# EAGLE design FunctionGeneratorGateDriver (EAGLE 9.3.2)
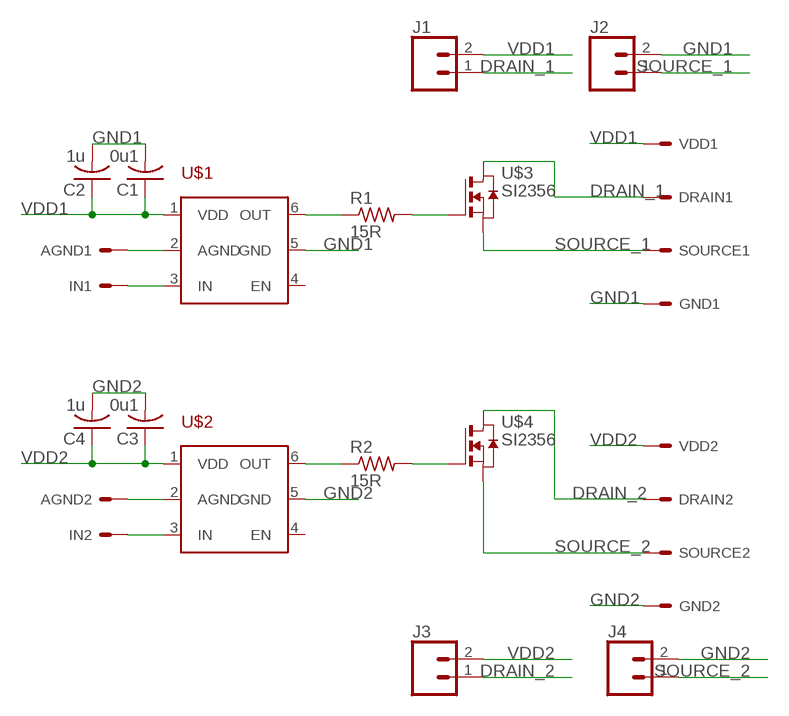
[diagram p0: schematic, sheet 1]

## Parts
AGND1  P1X1  [1X01]
AGND2  P1X1  [1X01]
C1  0u1  C-USC1206  [C1206]
C2  1u  C-USC1206  [C1206]
C3  0u1  C-USC1206  [C1206]
C4  1u  C-USC1206  [C1206]
DRAIN1  P1X1  [1X01]
DRAIN2  P1X1  [1X01]
GND1  P1X1  [1X01]
GND2  P1X1  [1X01]
IN1  P1X1  [1X01]
IN2  P1X1  [1X01]
J1  CONN_02  [1X02]
J2  CONN_02  [1X02]
J3  CONN_02  [1X02]
J4  CONN_02  [1X02]
R1  15R  R-US_R1206  [R1206]
R2  15R  R-US_R1206  [R1206]
SOURCE1  P1X1  [1X01]
SOURCE2  P1X1  [1X01]
U$1  MCP14A0152  [SOT95P270X150-6]
U$2  MCP14A0152  [SOT95P270X150-6]
U$3  SI2356  [SOT95P237X120-3]
U$4  SI2356  [SOT95P237X120-3]
VDD1  P1X1  [1X01]
VDD2  P1X1  [1X01]

## Nets
DRAIN_1 [pwr]: DRAIN1.1(MS) J1.1 U$3.3(D)
DRAIN_2 [pwr]: DRAIN2.1(MS) J3.1 U$4.3(D)
GND1 [pwr]: C1.2 C2.2 GND1.1(MS) J2.2 U$1.5(GND)
GND2 [pwr]: C3.2 C4.2 GND2.1(MS) J4.2 U$2.5(GND)
N$1: R2.1 U$2.6(OUT)
N$2: R2.2 U$4.1(G)
N$3: R1.1 U$1.6(OUT)
N$4: R1.2 U$3.1(G)
N$5: AGND1.1(MS) U$1.2(AGND)
N$6: IN1.1(MS) U$1.3(IN)
N$7: AGND2.1(MS) U$2.2(AGND)
N$8: IN2.1(MS) U$2.3(IN)
SOURCE_1 [pwr]: J2.1 SOURCE1.1(MS) U$3.2(S)
SOURCE_2 [pwr]: J4.1 SOURCE2.1(MS) U$4.2(S)
VDD1 [pwr]: C1.1 C2.1 J1.2 U$1.1(VDD) VDD1.1(MS)
VDD2 [pwr]: C3.1 C4.1 J3.2 U$2.1(VDD) VDD2.1(MS)
Unconnected: U$1.4(EN) U$2.4(EN)

## Library data of the parts
AGND1 AGND2 DRAIN1 DRAIN2 GND1 GND2 IN1 IN2 SOURCE1 SOURCE2 VDD1 VDD2 = TEMP:P1X1
C1-C4 = adafruit:C-US: CAPACITOR, American symbol
J1-J4 = SparkFun-Connectors:CONN_02: Multi connection point. Often used as Generic Header-pin footprint for 0.1 inch spaced/style header connections On any of the 0.1 inch spaced packages, you can populate with these: Break Away Headers - Straight <https://www.sparkfun.com/products/116> (PRT-00116) Break Away Male Headers - Right Angle <https://www.sparkfun.com/products/553> (PRT-00553) Female Headers <https://www.sparkfun.com/products/115> (PRT-00115) Break Away Headers - Machine Pin <https://www.sparkfun.com/products/117> (PRT-00117) Break Away Female Headers - Swiss Machine Pin <https://www.sparkfun.com/products/743> (PRT-00743) For SCREWTERMINALS and SPRING TERMINALS visit here: Screw Terimnals on SparkFun.com <https://www.sparkfun.com/search/results?term=Screw+Terminals> (5mm/3.5mm/2.54mm spacing) This device is also useful as a general connection point to wire up your design to another part of your project. Our various solder wires solder well into these plated through hole pads. Hook-Up Wire - Assortment (Stranded, 22 AWG) <https://www.sparkfun.com/products/11375> (PRT-11375) Hook-Up Wire - Assortment (Solid Core, 22 AWG) <https://www.sparkfun.com/products/11367> (PRT-11367) View the entire wire category on our website here <https://www.sparkfun.com/categories/141> Special notes: Molex polarized connector foot print use with: PRT-08233 with associated crimp pins and housings. 2.54_SCREWTERM for use with PRT-10571. 3.5mm Screw Terminal footprints for PRT-08084 5mm Screw Terminal footprints for use with PRT-08432
R1 R2 = adafruit:R-US_: RESISTOR, American symbol
U$1 U$2 = TEMP:MCP14A0152
U$3 U$4 = TEMP:SI2356

## Net classes
0 default: width 0.203 mm, drill 0.203 mm, clearance 0.203 mm
1 pwr: width 1.016 mm, drill 0.381 mm, clearance 0.254 mm

## Board
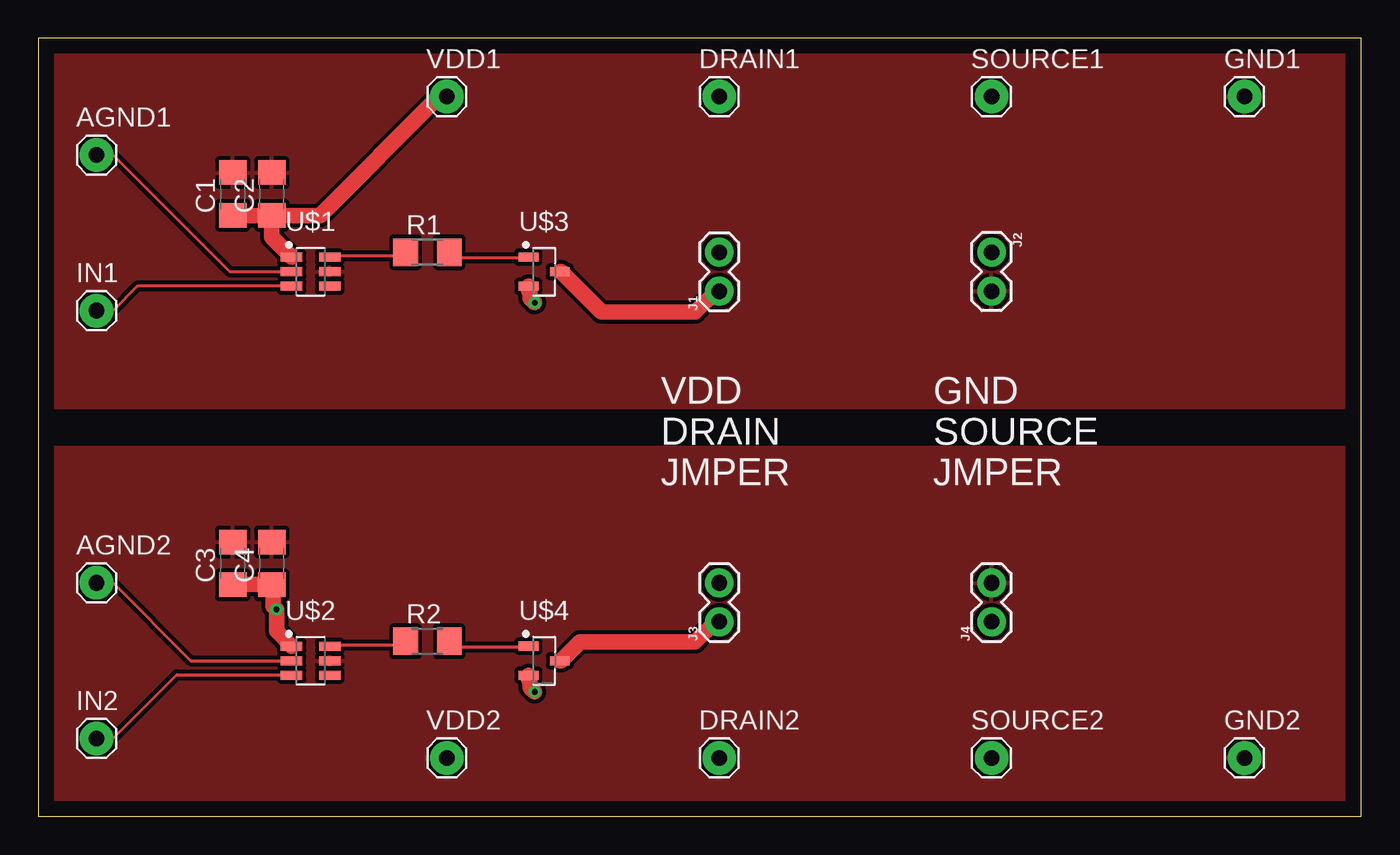
[diagram p1: board, top side]
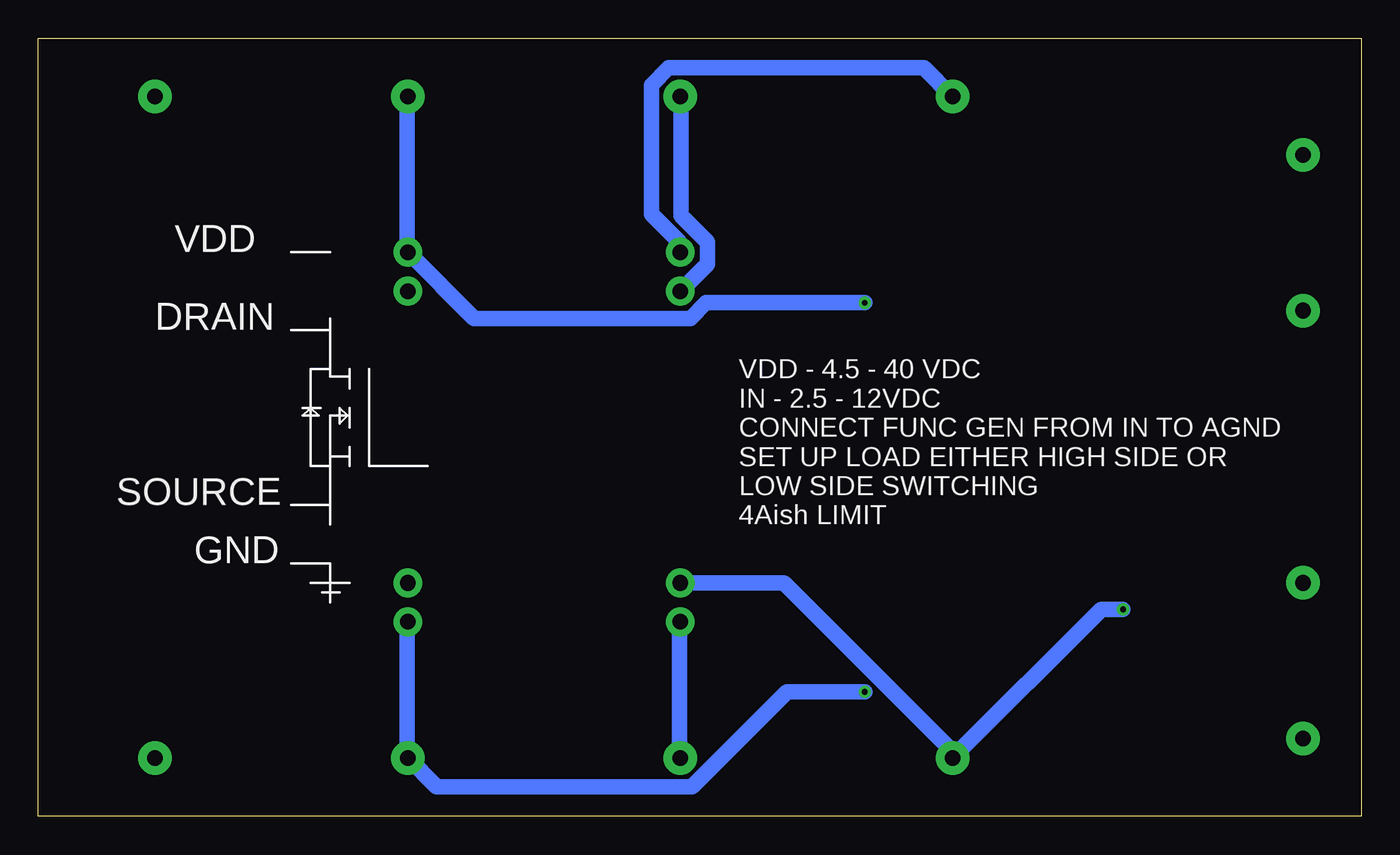
[diagram p2: board, bottom side, seen from below]

Size 86.36 x 50.8 mm. Coordinates in mm from the lower left corner, seen from the top.
Outline: 0,0 86.36,0 86.36,50.8 0,50.8 0,0
Copper layers (1*16): Top 0.035mm / dielectric 1.5mm / Bottom 0.035mm
Design rules "default": minimum track width 6mil, minimum drill 0.35mm, track to track 6mil, track to pad 6mil, pad to pad 6mil, via to via 6mil, smd to smd 6mil, copper to edge 40mil, drill to drill 6mil, minimum pad ring 10mil, minimum via ring 8mil, stop-mask expansion 4mil, vias tented up to drill 0mil, thermal gap 10mil

### Footprints (pad centres in the part's own frame; a part is rotated, then mirrored left to right if it is on the bottom)
1X01 = drill 1.016 pad 2.184: 1 0,0
C1206 = smd 1.6 x 1.8: 1 -1.4,0; 2 1.4,0
1X02 = drill 1.016 pad 1.88: 1 0,0; 2 2.54,0
R1206 = smd 1.6 x 1.803: 1 -1.422,0; 2 1.422,0
SOT95P270X150-6 = smd 1.412 x 0.59: 1 -1.247,0.95; 2 -1.247,0; 3 -1.247,-0.95; 4 1.247,-0.95; 5 1.247,0; 6 1.247,0.95
SOT95P237X120-3 = smd 1.298 x 0.597: 1 -1.027,0.95; 2 -1.027,-0.95; 3 1.027,0

### Placement (x,y rotation side)
AGND1  3.81,43.18 0 top
AGND2  3.81,15.24 0 top
C1  12.7,40.64 90 top
C2  15.24,40.64 90 top
C3  12.7,16.51 90 top
C4  15.24,16.51 90 top
DRAIN1  44.45,46.99 0 top
DRAIN2  44.45,3.81 0 top
GND1  78.74,46.99 0 top
GND2  78.74,3.81 0 top
IN1  3.81,33.02 0 top
IN2  3.81,5.08 0 top
J1  44.45,34.29 90 top
J2  62.23,36.83 270 top
J3  44.45,12.7 90 top
J4  62.23,12.7 90 top
R1  25.4,36.83 0 top
R2  25.4,11.43 0 top
SOURCE1  62.23,46.99 0 top
SOURCE2  62.23,3.81 0 top
U$1  17.78,35.56 0 top
U$2  17.78,10.16 0 top
U$3  33.02,35.56 0 top
U$4  33.02,10.16 0 top
VDD1  26.67,46.99 0 top
VDD2  26.67,3.81 0 top

### Tracks (layer width: path | path; a pad name or v marks a point on that pad's centre or on a via)
DRAIN_1
  Top 1.016: U$3.3 34.14,35.56 36.78,32.92 42.88,32.92 44.2,34.24 44.4,34.24 J1.1
  Bottom 1.016: J1.1 42.67,36.07 42.67,37.49 44.4,39.22 44.4,46.94 DRAIN1.1
DRAIN_2
  Top 1.016: J3.1 44.2,12.7 42.88,11.38 35.36,11.38 34.14,10.16 U$4.3
  Bottom 1.016: DRAIN2.1 44.5,3.86 44.5,12.7 J3.1
GND1
  pour Top: 0,26.67 86.36,26.67 86.36,50.8 0,50.8
GND2
  pour Top: 0,0 0,24.13 86.36,24.13 86.36,0
N$1
  Top 0.203: U$2.6 19.1,11.18 23.77,11.18 23.98,11.38 R2.1
N$2
  Top 0.203: U$4.1 31.9,11.07 27.13,11.07 26.82,11.38 R2.2
N$3
  Top 0.203: U$1.6 19.1,36.58 23.77,36.58 23.98,36.78 R1.1
N$4
  Top 0.203: U$3.1 31.9,36.47 27.13,36.47 26.82,36.78 R1.2
N$5
  Top 0.203: U$1.2 12.5,35.56 4.88,43.18 AGND1.1
N$6
  Top 0.203: IN1.1 4.88,33.02 6.5,34.65 16.46,34.65 U$1.3
N$7
  Top 0.203: U$2.2 9.96,10.16 4.88,15.24 AGND2.1
N$8
  Top 0.203: IN2.1 4.88,5.08 9.04,9.25 16.46,9.25 U$2.3
SOURCE_1  (via drill 0.38)
  Top 1.016: v32.41,33.53 32.11,33.83 32.11,34.24 32,34.34 32,34.54 U$3.2
  Bottom 1.016: v32.41,33.53 42.77,33.53 43.79,32.51 57.91,32.51 J2.1 62.28,37.29 62.28,46.94 SOURCE1.1
SOURCE_2  (via drill 0.38)
  Top 1.016: v32.41,8.13 32.11,8.43 32.11,8.84 32,8.94 32,9.14 U$4.2
  Bottom 1.016: v32.41,8.13 37.49,8.13 43.69,1.93 60.35,1.93 SOURCE2.1 62.28,4.27 62.28,12.7 J4.1
VDD1
  Top 1.016: 15.24,39.22 12.7,39.22 C1.1 | 15.24,39.22 C2.1 15.65,39.22 18.39,39.22 26.11,46.94 26.62,46.94 VDD1.1 | U$1.1 15.24,37.8 15.24,39.22
  Bottom 1.016: VDD1.1 28.55,48.87 45.21,48.87 46.33,47.75 46.33,39.32 44.5,37.49 44.5,36.88 J1.2
VDD2  (via drill 0.38)
  Top 1.016: C3.1 12.7,15.14 15.24,15.14 C4.1 15.34,14.63 15.34,13.72 v15.54,13.51 15.54,12.1 U$2.1
  Bottom 1.016: v15.54,13.51 16.97,13.51 VDD2.1 26.82,4.37 37.69,15.24 J3.2

### Text on the board
tPlace: VDD / DRAIN / JMPER | GND / SOURCE / JMPER
bPlace: VDD | DRAIN | SOURCE | VDD - 4.5 - 40 VDC / IN - 2.5 - 12VDC / CONNECT FUNC GEN FROM IN TO AGND / SET UP LOAD EITHER HIGH SIDE OR / LOW SIDE SWITCHING / 4Aish LIMIT | GND